# EAGLE design cpu_board (EAGLE 7.7.0)
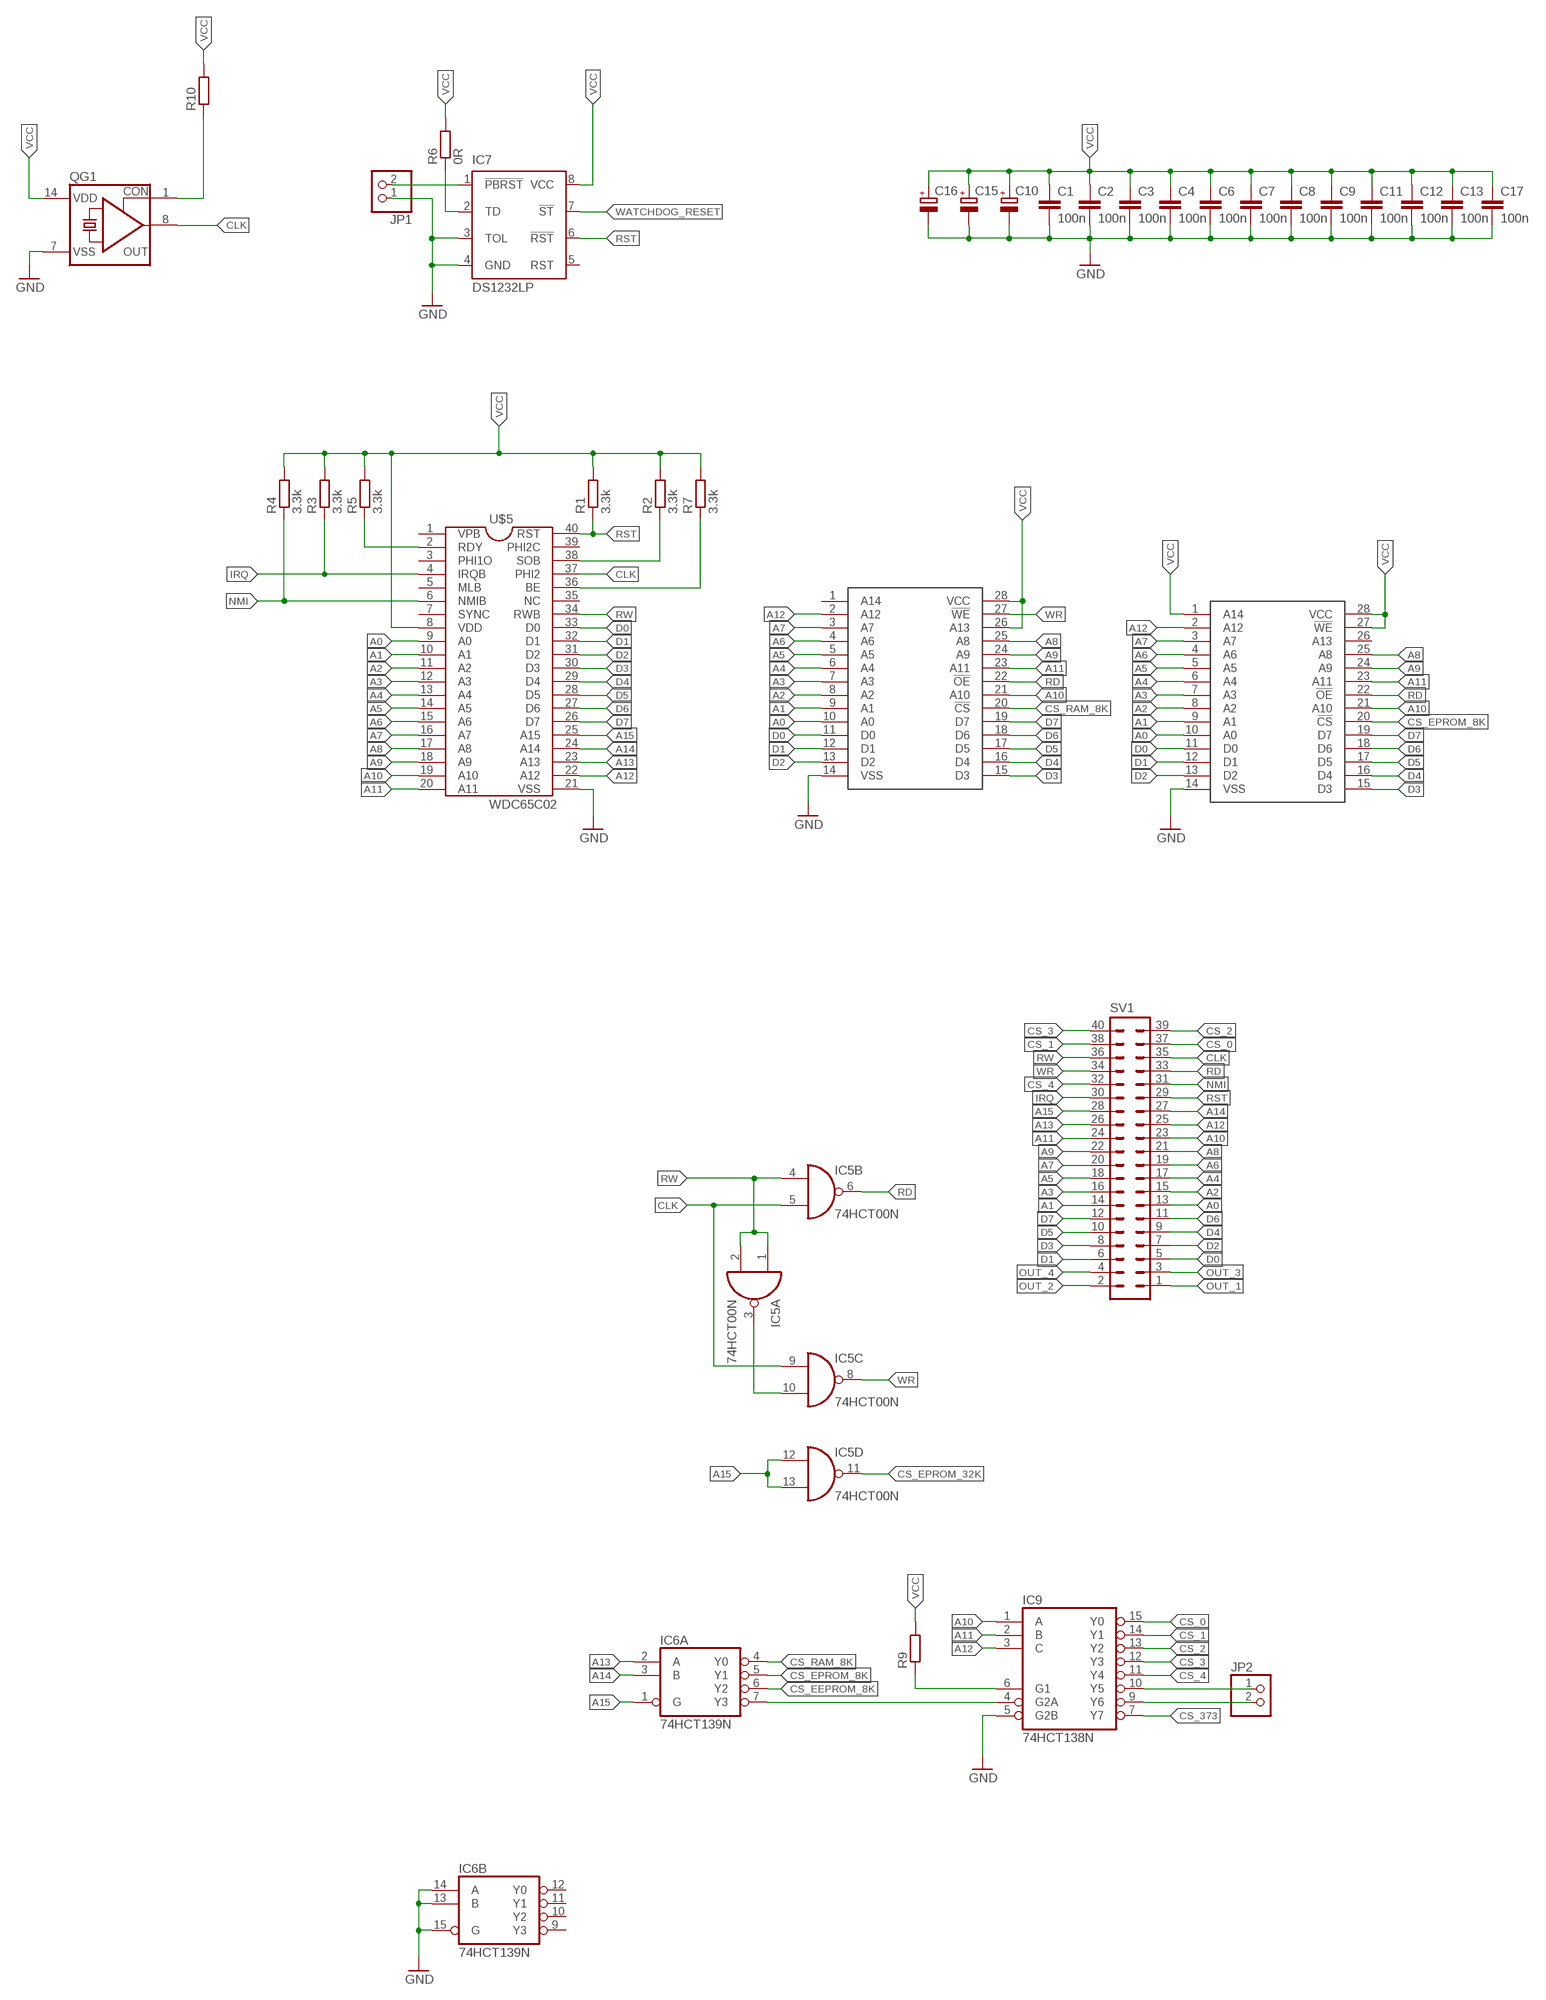
[diagram p0: schematic, sheet 1, part 1 of 2]
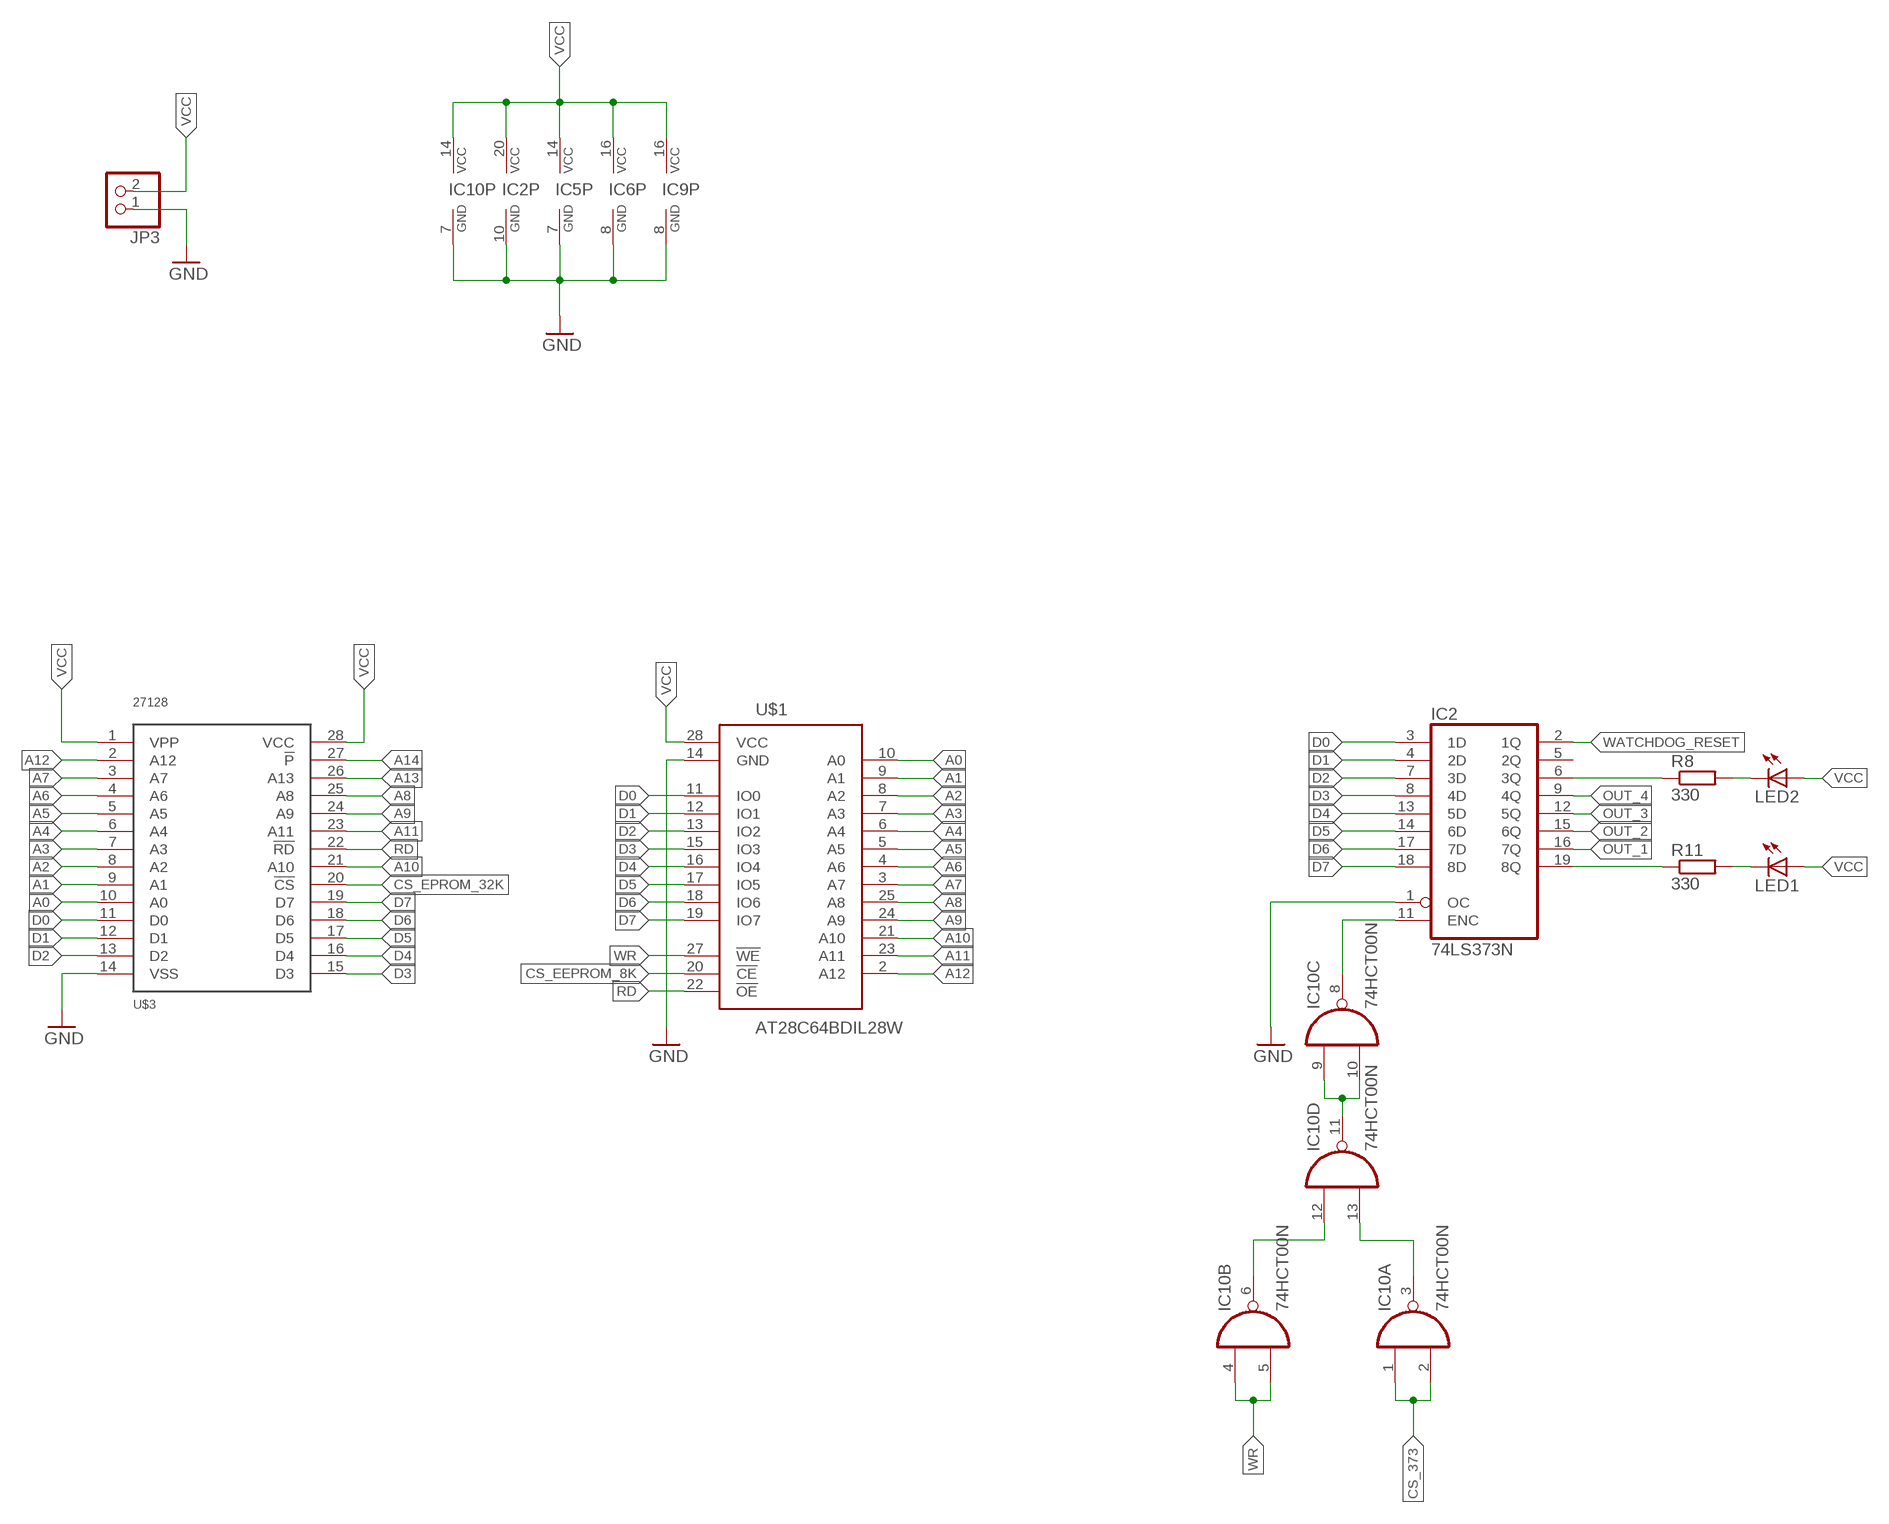
[diagram p1: schematic, sheet 1, part 2 of 2]

## Parts
C1  100n  C-EUC1206  [C1206]
C2  100n  C-EUC1206  [C1206]
C3  100n  C-EUC1206  [C1206]
C4  100n  C-EUC1206  [C1206]
C6  100n  C-EUC1206  [C1206]
C7  100n  C-EUC1206  [C1206]
C8  100n  C-EUC1206  [C1206]
C9  100n  C-EUC1206  [C1206]
C10  CPOL-EUE5-10.5  [E5-10,5]
C11  100n  C-EUC0805  [C0805]
C12  100n  C-EUC0805  [C0805]
C13  100n  C-EUC0805  [C0805]
C15  CPOL-EUSMCB  [SMC_B]
C16  CPOL-EUSMCB  [SMC_B]
C17  100n  C-EUC1206  [C1206]
IC2  74LS373N  [DIL20]
IC5  74HCT00N  [DIL14]
IC6  74HCT139N  [DIL16]
IC7  DS1232LP  [DIL08]
IC9  74HCT138N  [DIL16]
IC10  74HCT00N  [DIL14]
JP1  PINHD-1X2  [1X02]
JP2  PINHD-1X2  [1X02]
JP3  PINHD-1X2/90  [1X02/90]
LED1  LED5MM  [LED5MM]
LED2  LED5MM  [LED5MM]
QG1  CRYSTAL_RES-SG51  [SG51]
R1  3.3k  R-EU_R1206  [R1206]
R2  3.3k  R-EU_R1206  [R1206]
R3  3.3k  R-EU_R1206  [R1206]
R4  3.3k  R-EU_R1206  [R1206]
R5  3.3k  R-EU_R1206  [R1206]
R6  0R  R-EU_R1206  [R1206]
R7  3.3k  R-EU_R1206  [R1206]
R8  330  R-EU_R1206  [R1206]
R9  R-EU_0204/7  [0204/7]
R10  R-EU_R1206  [R1206]
R11  330  R-EU_R1206  [R1206]
SV1  ML40L  [ML40L]
U$1  AT28C64BDIL28W  [DIL28-6]
U$2  62256  [DIL28-6]
U$3  27128  [DIL28]
U$4  62256  [DIL28-6]
U$5  WDC65C02  [DIL40]

## Nets
A0: SV1.13 U$1.10(A0) U$2.10(A0) U$3.10(A0) U$4.10(A0) U$5.9(A0)
A1: SV1.14 U$1.9(A1) U$2.9(A1) U$3.9(A1) U$4.9(A1) U$5.10(A1)
A2: SV1.15 U$1.8(A2) U$2.8(A2) U$3.8(A2) U$4.8(A2) U$5.11(A2)
A3: SV1.16 U$1.7(A3) U$2.7(A3) U$3.7(A3) U$4.7(A3) U$5.12(A3)
A4: SV1.17 U$1.6(A4) U$2.6(A4) U$3.6(A4) U$4.6(A4) U$5.13(A4)
A5: SV1.18 U$1.5(A5) U$2.5(A5) U$3.5(A5) U$4.5(A5) U$5.14(A5)
A6: SV1.19 U$1.4(A6) U$2.4(A6) U$3.4(A6) U$4.4(A6) U$5.15(A6)
A7: SV1.20 U$1.3(A7) U$2.3(A7) U$3.3(A7) U$4.3(A7) U$5.16(A7)
A8: SV1.21 U$1.25(A8) U$2.25(A8) U$3.25(A8) U$4.25(A8) U$5.17(A8)
A9: SV1.22 U$1.24(A9) U$2.24(A9) U$3.24(A9) U$4.24(A9) U$5.18(A9)
A10: IC9.1(A) SV1.23 U$1.21(A10) U$2.21(A10) U$3.21(A10) U$4.21(A10) U$5.19(A10)
A11: IC9.2(B) SV1.24 U$1.23(A11) U$2.23(A11) U$3.23(A11) U$4.23(A11) U$5.20(A11)
A12: IC9.3(C) SV1.25 U$1.2(A12) U$2.2(A12) U$3.2(A12) U$4.2(A12) U$5.22(A12)
A13: IC6.2(A:A) SV1.26 U$3.26(A13) U$5.23(A13)
A14: IC6.3(A:B) SV1.27 U$3.27(!P) U$5.24(A14)
A15: IC5.12(D:I0) IC5.13(D:I1) IC6.1(A:G) SV1.28 U$5.25(A15)
CLK: IC5.5(B:I1) IC5.9(C:I0) QG1.8(OUT) SV1.35 U$5.37(PHI2)
CS_0: IC9.15(Y0) SV1.37
CS_1: IC9.14(Y1) SV1.38
CS_2: IC9.13(Y2) SV1.39
CS_3: IC9.12(Y3) SV1.40
CS_4: IC9.11(Y4) SV1.32
CS_373: IC9.7(Y7) IC10.1(A:I0) IC10.2(A:I1)
CS_EEPROM_8K: IC6.6(A:Y2) U$1.20(!CE)
CS_EPROM_8K: IC6.5(A:Y1) U$2.20(!CS)
CS_EPROM_32K: IC5.11(D:O) U$3.20(!CS)
CS_RAM_8K: IC6.4(A:Y0) U$4.20(!CS)
D0: IC2.3(1D) SV1.5 U$1.11(IO0) U$2.11(D0) U$3.11(D0) U$4.11(D0) U$5.33(D0)
D1: IC2.4(2D) SV1.6 U$1.12(IO1) U$2.12(D1) U$3.12(D1) U$4.12(D1) U$5.32(D1)
D2: IC2.7(3D) SV1.7 U$1.13(IO2) U$2.13(D2) U$3.13(D2) U$4.13(D2) U$5.31(D2)
D3: IC2.8(4D) SV1.8 U$1.15(IO3) U$2.15(D3) U$3.15(D3) U$4.15(D3) U$5.30(D3)
D4: IC2.13(5D) SV1.9 U$1.16(IO4) U$2.16(D4) U$3.16(D4) U$4.16(D4) U$5.29(D4)
D5: IC2.14(6D) SV1.10 U$1.17(IO5) U$2.17(D5) U$3.17(D5) U$4.17(D5) U$5.28(D5)
D6: IC2.17(7D) SV1.11 U$1.18(IO6) U$2.18(D6) U$3.18(D6) U$4.18(D6) U$5.27(D6)
D7: IC2.18(8D) SV1.12 U$1.19(IO7) U$2.19(D7) U$3.19(D7) U$4.19(D7) U$5.26(D7)
GND: C1.2 C2.2 C3.2 C4.2 C6.2 C7.2 C8.2 C9.2 C10.- C11.2 C12.2 C13.2 C15.- C16.- C17.2 IC2.1(OC) IC2.10(GND) IC5.7(P:GND) IC6.8(P:GND) IC6.13(B:B) IC6.14(B:A) IC6.15(B:G) IC7.3(TOL) IC7.4(GND) IC9.5(G2B) IC9.8(GND) IC10.7(P:GND) JP1.1 JP3.1 QG1.7(VSS) U$1.14(GND) U$2.14(VSS) U$3.14(VSS) U$4.14(VSS) U$5.21(VSS)
IRQ: R3.1 SV1.30 U$5.4(IRQB)
N$1: IC7.2(TD) R6.1
N$2: R2.1 U$5.38(SOB)
N$3: IC7.1(!PBRST) JP1.2
N$4: R7.1 U$5.36(BE)
N$5: R5.1 U$5.2(RDY)
N$6: IC2.19(8Q) R11.1
N$7: QG1.1(CON) R10.1
N$8: IC6.7(A:Y3) IC9.4(G2A)
N$9: LED1.K(C) R11.2
N$11: IC2.11(ENC) IC10.8(C:O)
N$12: IC10.9(C:I0) IC10.10(C:I1) IC10.11(D:O)
N$13: IC10.3(A:O) IC10.13(D:I1)
N$14: IC10.6(B:O) IC10.12(D:I0)
N$15: IC2.6(3Q) R8.1
N$16: IC9.10(Y5) JP2.1
N$17: LED2.K(C) R8.2
N$18: IC5.3(A:O) IC5.10(C:I1)
N$20: IC9.6(G1) R9.1
N$22: IC9.9(Y6) JP2.2
NMI: R4.1 SV1.31 U$5.6(NMIB)
OUT_1: IC2.16(7Q) SV1.1
OUT_2: IC2.15(6Q) SV1.2
OUT_3: IC2.12(5Q) SV1.3
OUT_4: IC2.9(4Q) SV1.4
RD: IC5.6(B:O) SV1.33 U$1.22(!OE) U$2.22(!OE) U$3.22(!RD) U$4.22(!OE)
RST: IC7.6(!RST) R1.1 SV1.29 U$5.40(RST)
RW: IC5.1(A:I0) IC5.2(A:I1) IC5.4(B:I0) SV1.36 U$5.34(RWB)
VCC: C1.1 C2.1 C3.1 C4.1 C6.1 C7.1 C8.1 C9.1 C10.+ C11.1 C12.1 C13.1 C15.+ C16.+ C17.1 IC2.20(VCC) IC5.14(P:VCC) IC6.16(P:VCC) IC7.8(VCC) IC9.16(VCC) IC10.14(P:VCC) JP3.2 LED1.A LED2.A QG1.14(VDD) R1.2 R2.2 R3.2 R4.2 R5.2 R6.2 R7.2 R9.2 R10.2 U$1.28(VCC) U$2.1(A14) U$2.27(!WE) U$2.28(VCC) U$3.1(VPP) U$3.28(VCC) U$4.26(A13) U$4.28(VCC) U$5.8(VDD)
WATCHDOG_RESET: IC2.2(1Q) IC7.7(!ST)
WR: IC5.8(C:O) IC10.4(B:I0) IC10.5(B:I1) SV1.34 U$1.27(!WE) U$4.27(!WE)
Unconnected: IC2.5(2Q) IC6.9(B:Y3) IC6.10(B:Y2) IC6.11(B:Y1) IC6.12(B:Y0) IC7.5(RST) U$2.26(A13) U$4.1(A14) U$5.1(VPB) U$5.3(PHI1O) U$5.5(MLB) U$5.7(SYNC) U$5.35(NC) U$5.39(PHI2C)

## Library data of the parts
C1-C4 C6-C9 C11-C13 C17 = rcl:C-EU: CAPACITOR, European symbol
C10 C15 C16 = rcl:CPOL-EU: POLARIZED CAPACITOR, European symbol
IC2 = 74xx-eu:74*373: Octal D type transparent LATCH, edge triggered
IC5 IC10 = 74xx-eu:74*00: Quad 2-input NAND gate
IC6 = 74xx-eu:74*139: Dual 2-line to 4-line DECODER/DEMULTIPLEXER
IC7 = texas:DS1232LP: Low Power MicroMonitor Chip Source: DALLAS SEMICONDUCTOR .. 1232lp.pdf; MPN: DS1232LP+; OC_FARNELL: 1187997; OC_NEWARK: 68K3327
IC9 = 74xx-eu:74*138: 3-line to 8-line DECODER/DEMULTIPLEXER
JP1-JP3 = pinhead:PINHD-1X2: PIN HEADER
LED1 LED2 = led:LED: LED OSRAM: - CHIPLED LG R971, LG N971, LY N971, LG Q971, LY Q971, LO R971, LY R971 LH N974, LH R974 LS Q976, LO Q976, LY Q976 LO Q996 - Hyper CHIPLED LW Q18S LB Q993, LB Q99A, LB R99A - SideLED LS A670, LO A670, LY A670, LG A670, LP A670 LB A673, LV A673, LT A673, LW A673 LH A674 LY A675 LS A676, LA A676, LO A676, LY A676, LW A676 LS A679, LY A679, LG A679 - Hyper Micro SIDELED® LS Y876, LA Y876, LO Y876, LY Y876 LT Y87S - SmartLED LW L88C, LW L88S LB L89C, LB L89S, LG L890 LS L89K, LO L89K, LY L89K LS L896, LA L896, LO L896, LY L896 - TOPLED LS T670, LO T670, LY T670, LG T670, LP T670 LSG T670, LSP T670, LSY T670, LOP T670, LYG T670 LG T671, LOG T671, LSG T671 LB T673, LV T673, LT T673, LW T673 LH T674 LS T676, LA T676, LO T676, LY T676, LB T676, LH T676, LSB T676, LW T676 LB T67C, LV T67C, LT T67C, LS T67K, LO T67K, LY T67K, LW E67C LS E67B, LA E67B, LO E67B, LY E67B, LB E67C, LV E67C, LT E67C LW T67C LS T679, LY T679, LG T679 LS T770, LO T770, LY T770, LG T770, LP T770 LB T773, LV T773, LT T773, LW T773 LH T774 LS E675, LA E675, LY E675, LS T675 LS T776, LA T776, LO T776, LY T776, LB T776 LHGB T686 LT T68C, LB T68C - Hyper Mini TOPLED® LB M676 - Mini TOPLED Santana® LG M470 LS M47K, LO M47K, LY M47K Source: http://www.osram.convergy.de LUXEON: - LUMILED® LXK2-PW12-R00, LXK2-PW12-S00, LXK2-PW14-U00, LXK2-PW14-V00 LXK2-PM12-R00, LXK2-PM12-S00, LXK2-PM14-U00 LXK2-PE12-Q00, LXK2-PE12-R00, LXK2-PE12-S00, LXK2-PE14-T00, LXK2-PE14-U00 LXK2-PB12-K00, LXK2-PB12-L00, LXK2-PB12-M00, LXK2-PB14-N00, LXK2-PB14-P00, LXK2-PB14-Q00 LXK2-PR12-L00, LXK2-PR12-M00, LXK2-PR14-Q00, LXK2-PR14-R00 LXK2-PD12-Q00, LXK2-PD12-R00, LXK2-PD12-S00 LXK2-PH12-R00, LXK2-PH12-S00 LXK2-PL12-P00, LXK2-PL12-Q00, LXK2-PL12-R00 Source: www.luxeon.com KINGBRIGHT: KA-3528ASYC Source: www.kingbright.com
QG1 = crystal:CRYSTAL_RES-: CRYSTAL RESONATOR; OC_FARNELL: unknown; OC_NEWARK: unknown
R1-R11 = rcl:R-EU_: RESISTOR, European symbol
SV1 = con-harting-ml:ML40: HARTING; OC_FARNELL: unknown; OC_NEWARK: unknown
U$1 = bt_memory:AT28C64B: AT28C64B EEPROM The AT28C64B is a high-performance electrically-erasable and programmable read-only memory (EEPROM). Its 64K of memory is organized as 8,192 words by 8 bits. Manufactured with Atmel’s advanced nonvolatile CMOS technology, the device offers access times to 150 ns with power dissipation of just 220 mW. When the device is deselected, the CMOS standby current is less than 100 µA.
U$2 U$4 = memory-sram:62256
U$3 = mw:27128
U$5 = Mos6502:WDC65C02

## Board
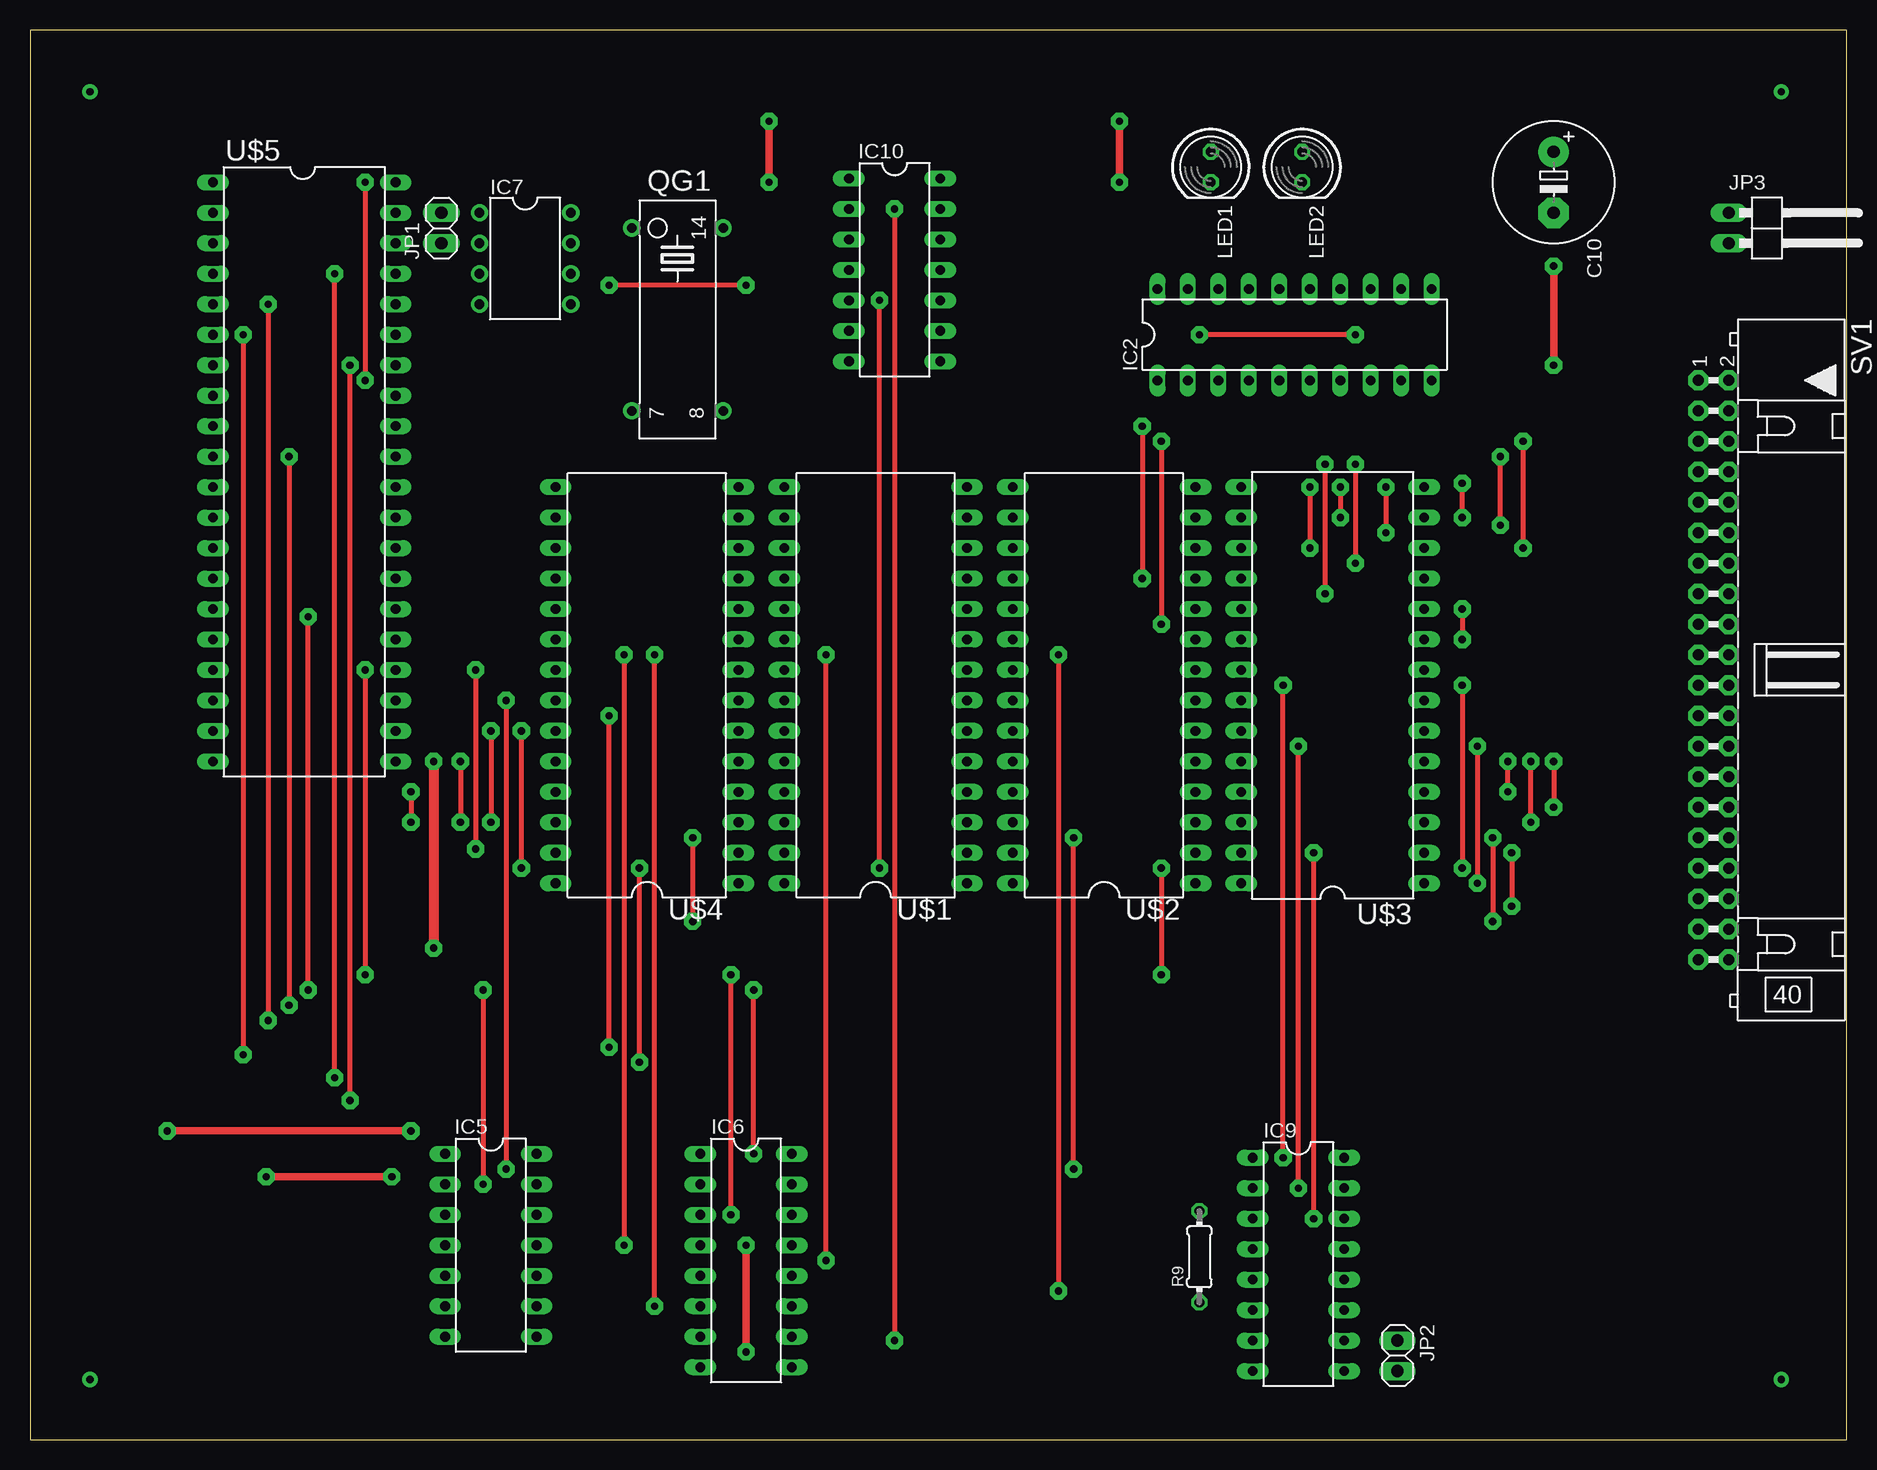
[diagram p2: board, top side]
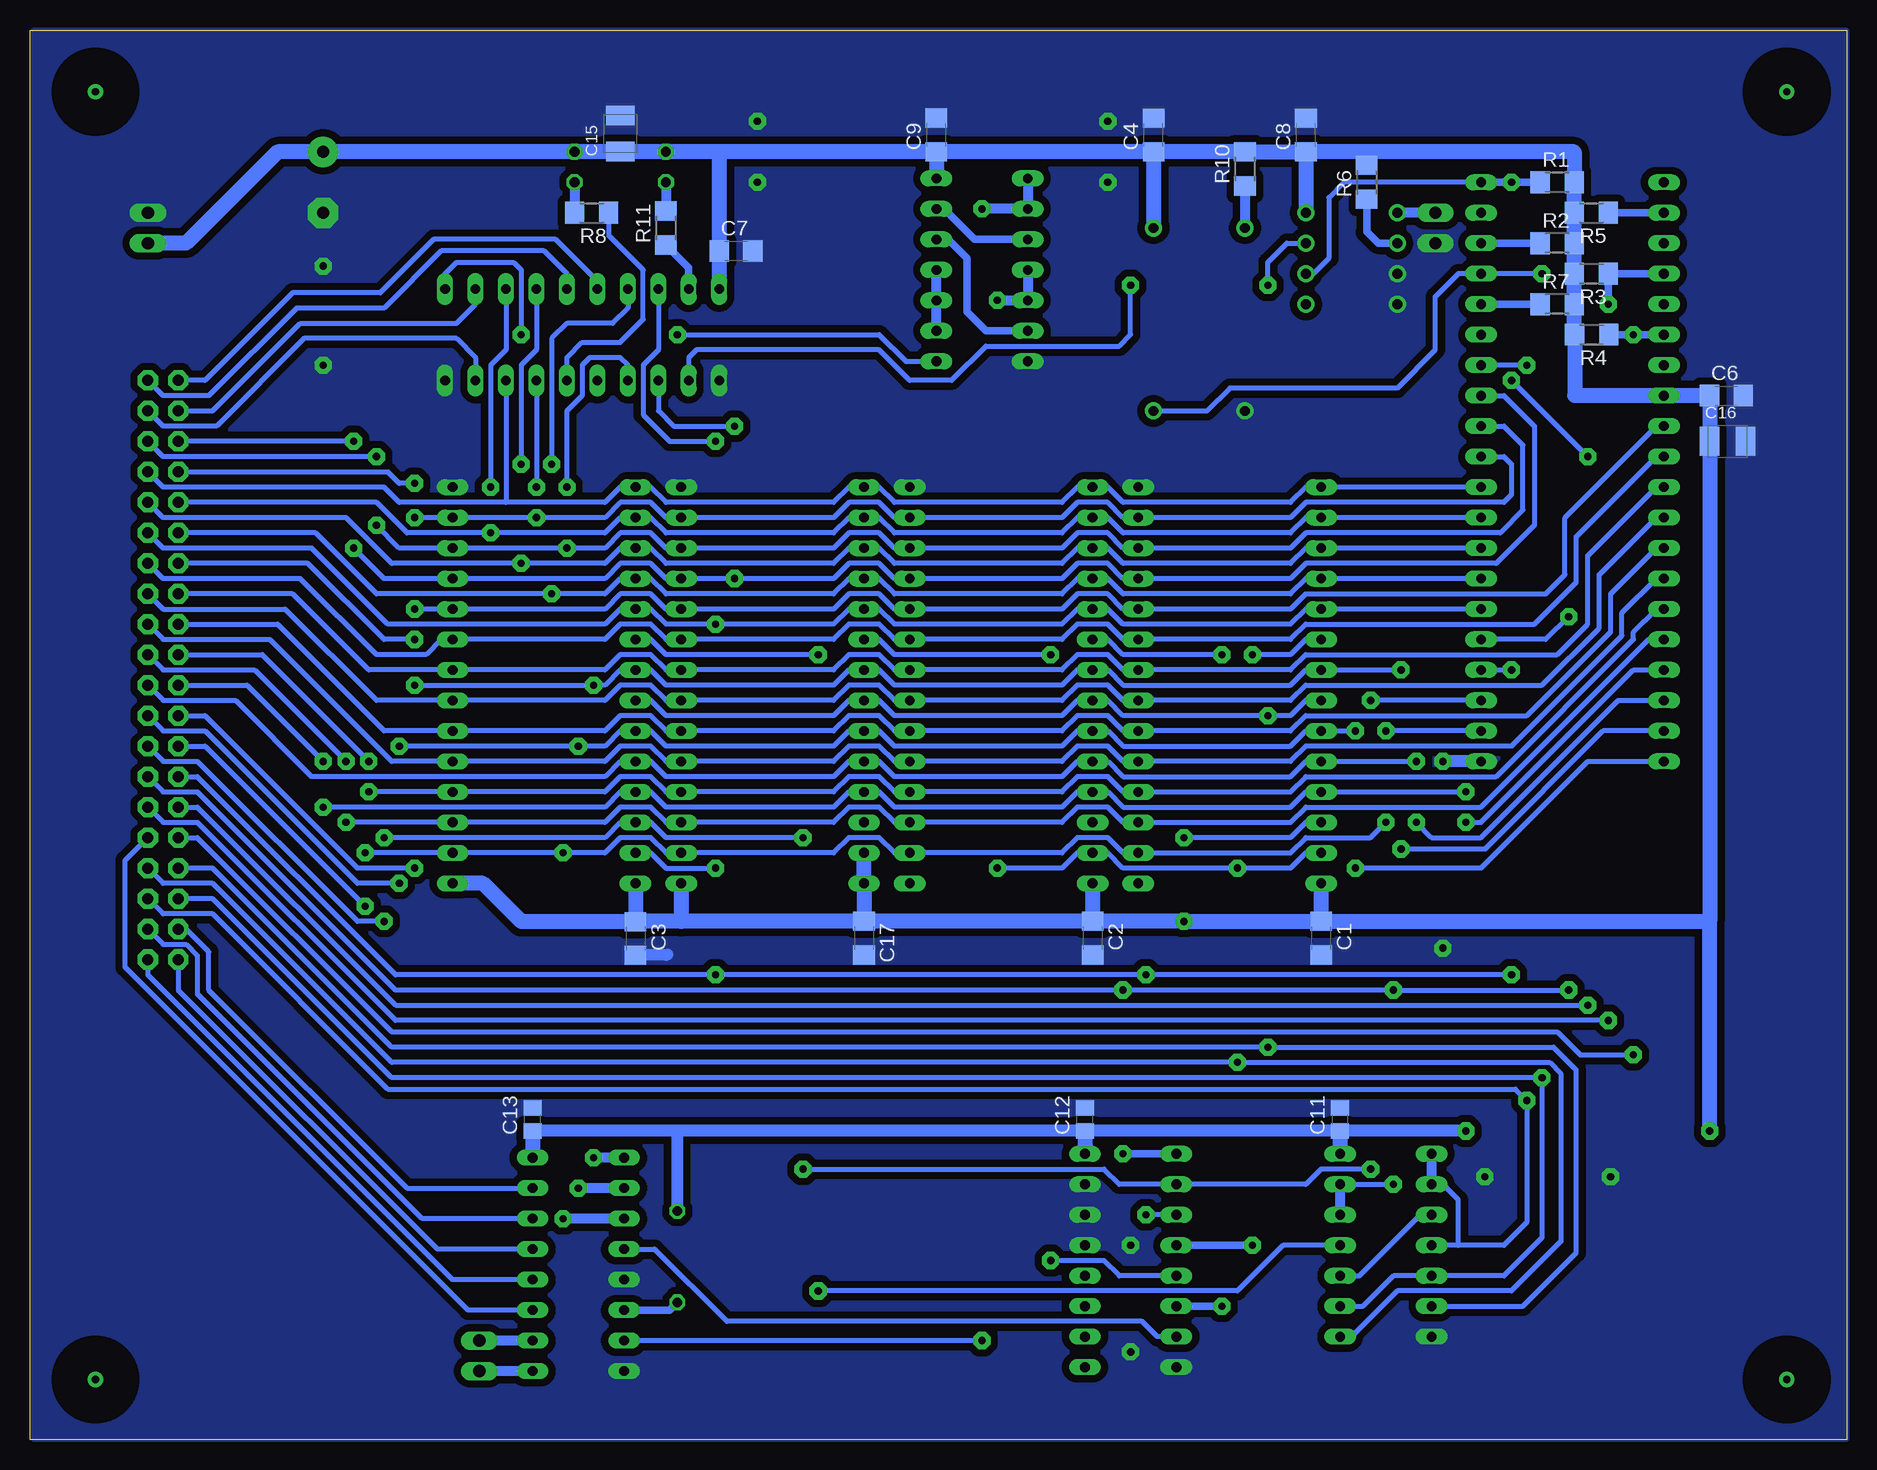
[diagram p3: board, bottom side, seen from below]

Size 151.44 x 117.47 mm. Coordinates in mm from the lower left corner, seen from the top.
Outline: 0,0 151.44,0 151.44,117.47 0,117.47 0,0
Copper layers (1*16): Top 0.035mm / dielectric 1.5mm / Bottom 0.035mm
Design rules "default *": minimum track width 10mil, minimum drill 24mil, track to track 8mil, track to pad 8mil, pad to pad 8mil, via to via 8mil, smd to smd 8mil, copper to edge 0mil, drill to drill 8mil, minimum pad ring 10mil, minimum via ring 8mil, stop-mask expansion 4mil, vias tented up to drill 0mil, thermal gap 10mil
bRestrict: area 2,2 to 8,8; area 2,109.3 to 8,115.4; area 142.9,2 to 149,8; area 142.9,109.3 to 149,115.4

### Footprints (pad centres in the part's own frame; a part is rotated, then mirrored left to right if it is on the bottom)
C1206 = smd 1.6 x 1.8: 1 -1.4,0; 2 1.4,0
E5-10,5 = drill 1.016 pad 2.54: + -2.54,0 | drill 1.016 pad 2.54 octagon: - 2.54,0
C0805 = smd 1.3 x 1.5: 1 -0.95,0; 2 0.95,0
SMC_B = smd 1.6 x 2.4: + -1.5,0; - 1.5,0
DIL20 = drill 0.813 long: 1 -11.43,-3.81; 2 -8.89,-3.81; 3 -6.35,-3.81; 4 -3.81,-3.81; 5 -1.27,-3.81; 6 1.27,-3.81; 7 3.81,-3.81; 8 6.35,-3.81; 9 8.89,-3.81; 10 11.43,-3.81; 11 11.43,3.81; 12 8.89,3.81; 13 6.35,3.81; 14 3.81,3.81; 15 1.27,3.81; 16 -1.27,3.81; 17 -3.81,3.81; 18 -6.35,3.81; 19 -8.89,3.81; 20 -11.43,3.81
DIL14 = drill 0.813 long: 1 -7.62,-3.81; 2 -5.08,-3.81; 3 -2.54,-3.81; 4 0,-3.81; 5 2.54,-3.81; 6 5.08,-3.81; 7 7.62,-3.81; 8 7.62,3.81; 9 5.08,3.81; 10 2.54,3.81; 11 0,3.81; 12 -2.54,3.81; 13 -5.08,3.81; 14 -7.62,3.81
DIL16 = drill 0.813 long: 1 -8.89,-3.81; 2 -6.35,-3.81; 3 -3.81,-3.81; 4 -1.27,-3.81; 5 1.27,-3.81; 6 3.81,-3.81; 7 6.35,-3.81; 8 8.89,-3.81; 9 8.89,3.81; 10 6.35,3.81; 11 3.81,3.81; 12 1.27,3.81; 13 -1.27,3.81; 14 -3.81,3.81; 15 -6.35,3.81; 16 -8.89,3.81
DIL08 = drill 0.813 pad 1.422: 1 -3.81,-3.81; 2 -1.27,-3.81; 3 1.27,-3.81; 4 3.81,-3.81; 5 3.81,3.81; 6 1.27,3.81; 7 -1.27,3.81; 8 -3.81,3.81
1X02 = drill 1.016 long: 1 -1.27,0; 2 1.27,0
1X02/90 = drill 1.016 long: 1 -1.27,-3.81; 2 1.27,-3.81
LED5MM = drill 0.813 octagon: A -1.27,0; K 1.27,0
SG51 = drill 0.813 pad 1.422: 1 -7.62,-3.81; 7 7.62,-3.81; 8 7.62,3.81; 14 -7.62,3.81
R1206 = smd 1.6 x 1.803: 1 -1.422,0; 2 1.422,0
0204/7 = drill 0.813 octagon: 1 -3.81,0; 2 3.81,0
ML40L = drill 0.914 pad 1.676 octagon: 1 -24.13,-1.27; 2 -24.13,1.27; 3 -21.59,-1.27; 4 -21.59,1.27; 5 -19.05,-1.27; 6 -19.05,1.27; 7 -16.51,-1.27; 8 -16.51,1.27; 9 -13.97,-1.27; 10 -13.97,1.27; 11 -11.43,-1.27; 12 -11.43,1.27; 13 -8.89,-1.27; 14 -8.89,1.27; 15 -6.35,-1.27; 16 -6.35,1.27; 17 -3.81,-1.27; 18 -3.81,1.27; 19 -1.27,-1.27; 20 -1.27,1.27; 21 1.27,-1.27; 22 1.27,1.27; 23 3.81,-1.27; 24 3.81,1.27; 25 6.35,-1.27; 26 6.35,1.27; 27 8.89,-1.27; 28 8.89,1.27; 29 11.43,-1.27; 30 11.43,1.27; 31 13.97,-1.27; 32 13.97,1.27; 33 16.51,-1.27; 34 16.51,1.27; 35 19.05,-1.27; 36 19.05,1.27; 37 21.59,-1.27; 38 21.59,1.27; 39 24.13,-1.27; 40 24.13,1.27
DIL28-6 = drill 0.813 long: 1 -16.51,-7.62; 2 -13.97,-7.62; 3 -11.43,-7.62; 4 -8.89,-7.62; 5 -6.35,-7.62; 6 -3.81,-7.62; 7 -1.27,-7.62; 8 1.27,-7.62; 9 3.81,-7.62; 10 6.35,-7.62; 11 8.89,-7.62; 12 11.43,-7.62; 13 13.97,-7.62; 14 16.51,-7.62; 15 16.51,7.62; 16 13.97,7.62; 17 11.43,7.62; 18 8.89,7.62; 19 6.35,7.62; 20 3.81,7.62; 21 1.27,7.62; 22 -1.27,7.62; 23 -3.81,7.62; 24 -6.35,7.62; 25 -8.89,7.62; 26 -11.43,7.62; 27 -13.97,7.62; 28 -16.51,7.62
DIL28 = drill 0.813 long: 1 -16.51,-7.62; 2 -13.97,-7.62; 3 -11.43,-7.62; 4 -8.89,-7.62; 5 -6.35,-7.62; 6 -3.81,-7.62; 7 -1.27,-7.62; 8 1.27,-7.62; 9 3.81,-7.62; 10 6.35,-7.62; 11 8.89,-7.62; 12 11.43,-7.62; 13 13.97,-7.62; 14 16.51,-7.62; 15 16.51,7.62; 16 13.97,7.62; 17 11.43,7.62; 18 8.89,7.62; 19 6.35,7.62; 20 3.81,7.62; 21 1.27,7.62; 22 -1.27,7.62; 23 -3.81,7.62; 24 -6.35,7.62; 25 -8.89,7.62; 26 -11.43,7.62; 27 -13.97,7.62; 28 -16.51,7.62
DIL40 = drill 0.813 long: 1 -24.13,-7.62; 2 -21.59,-7.62; 3 -19.05,-7.62; 4 -16.51,-7.62; 5 -13.97,-7.62; 6 -11.43,-7.62; 7 -8.89,-7.62; 8 -6.35,-7.62; 9 -3.81,-7.62; 10 -1.27,-7.62; 11 1.27,-7.62; 12 3.81,-7.62; 13 6.35,-7.62; 14 8.89,-7.62; 15 11.43,-7.62; 16 13.97,-7.62; 17 16.51,-7.62; 18 19.05,-7.62; 19 21.59,-7.62; 20 24.13,-7.62; 21 24.13,7.62; 22 21.59,7.62; 23 19.05,7.62; 24 16.51,7.62; 25 13.97,7.62; 26 11.43,7.62; 27 8.89,7.62; 28 6.35,7.62; 29 3.81,7.62; 30 1.27,7.62; 31 -1.27,7.62; 32 -3.81,7.62; 33 -6.35,7.62; 34 -8.89,7.62; 35 -11.43,7.62; 36 -13.97,7.62; 37 -16.51,7.62; 38 -19.05,7.62; 39 -21.59,7.62; 40 -24.13,7.62

### Placement (x,y rotation side)
C1  43.81,41.78 270 bottom
C2  62.87,41.78 270 bottom
C3  100.97,41.76 270 bottom
C4  57.78,108.71 90 bottom
C6  10.03,87 0 bottom
C7  92.58,99.06 0 bottom
C8  45.09,108.71 90 bottom
C9  75.88,108.72 90 bottom
C10  127,104.78 270 top
C11  42.23,26.67 90 bottom
C12  63.5,26.67 90 bottom
C13  109.54,26.67 90 bottom
C15  102.23,108.84 90 bottom
C16  9.93,83.19 0 bottom
C17  81.92,41.78 270 bottom
IC2  105.41,92.08 0 top
IC5  38.42,16.19 270 top
IC6  59.69,14.92 270 top
IC7  41.27,98.42 270 top
IC9  105.73,14.61 270 top
IC10  72.07,97.47 270 top
JP1  34.29,100.97 90 top
JP2  113.98,6.99 270 top
JP3  145.41,100.97 270 top
LED1  98.42,106.05 270 top
LED2  106.05,106.05 270 top
QG1  53.98,93.34 270 top
R1  24.13,104.78 0 bottom
R2  24.13,99.69 0 bottom
R3  21.29,97.16 180 bottom
R4  21.26,92.08 180 bottom
R5  21.29,102.23 180 bottom
R6  40.01,104.78 90 bottom
R7  24.13,94.61 0 bottom
R8  104.62,102.23 180 bottom
R9  97.47,15.24 90 top
R10  50.16,105.89 90 bottom
R11  98.42,100.97 90 bottom
SV1  140.34,64.14 270 top
U$1  70.48,62.87 90 top
U$2  89.53,62.87 90 top
U$3  108.58,62.87 90 top
U$4  51.44,62.87 90 top
U$5  22.86,80.64 270 top

### Tracks (layer width: path | path; a pad name or v marks a point on that pad's centre or on a via)
A0  (via drill 0.6 pad 1.42)
  Top 0.406: v119.38,69.22 v119.38,66.67
  Bottom 0.406: U$5.9 15.88,84.45 23.5,76.83 23.5,72.07 25.08,70.48 45.09,70.48 46.35,69.22 U$4.10 60.33,69.22 61.59,70.48 64.14,70.48 65.41,69.22 U$1.10 79.38,69.22 80.64,70.48 83.19,70.48 84.45,69.22 U$2.10 98.42,69.22 99.69,70.48 102.23,70.48 103.5,69.22 U$3.10 v119.38,69.22 | v119.38,66.67 121.92,66.67 128.27,73.03 SV1.13
A1
  Bottom 0.406: U$5.10 15.88,81.92 22.54,75.25 22.54,71.44 26.04,67.94 45.09,67.94 46.35,66.67 U$4.9 60.33,66.67 61.59,67.94 64.14,67.94 65.41,66.67 U$1.9 79.38,66.67 80.64,67.94 83.19,67.94 84.45,66.67 U$2.9 98.42,66.67 99.69,67.94 102.23,67.94 103.5,66.67 U$3.9 117.16,66.67 118.43,65.41 122.56,65.41 128.91,71.75 140.34,71.75 SV1.14
A2
  Bottom 0.406: U$5.11 15.88,79.38 21.59,73.66 21.59,67.94 24.13,65.41 45.09,65.41 46.35,64.14 U$4.8 60.33,64.14 61.59,65.41 64.14,65.41 65.41,64.14 U$1.8 79.38,64.14 80.64,65.41 83.19,65.41 84.45,64.14 U$2.8 98.42,64.14 99.69,65.41 102.23,65.41 103.5,64.14 U$3.8 123.19,64.14 129.54,70.48 SV1.15
A3
  Bottom 0.406: U$5.12 15.88,76.83 20.64,72.07 20.64,67.63 25.4,62.87 45.09,62.87 46.35,61.59 U$4.7 60.33,61.59 61.59,62.87 64.14,62.87 65.41,61.59 U$1.7 79.38,61.59 80.64,62.87 83.19,62.87 84.45,61.59 U$2.7 98.42,61.59 99.69,62.87 102.23,62.87 103.5,61.59 U$3.7 122.56,61.59 130.18,69.22 140.34,69.22 SV1.16
A4
  Bottom 0.406: U$5.13 15.88,74.3 19.68,70.48 19.68,67.31 26.67,60.33 45.09,60.33 46.35,59.05 U$4.6 60.33,59.05 61.59,60.33 64.14,60.33 65.41,59.05 U$1.6 79.38,59.05 80.64,60.33 83.19,60.33 84.45,59.05 U$2.6 98.42,59.05 99.69,60.33 102.23,60.33 103.5,59.05 U$3.6 121.92,59.05 130.81,67.94 SV1.17
A5
  Bottom 0.406: U$5.14 15.88,71.75 18.73,68.9 18.73,66.99 27.94,57.78 45.09,57.78 46.35,56.52 U$4.5 60.33,56.52 61.59,57.78 64.14,57.78 65.41,56.52 U$1.5 79.38,56.52 80.64,57.78 83.19,57.78 84.45,56.52 U$2.5 98.42,56.52 99.69,57.78 102.23,57.78 103.5,56.52 U$3.5 121.28,56.52 131.44,66.67 140.34,66.67 SV1.18
A6  (via drill 0.6 pad 1.42)
  Top 0.406: v123.19,53.98 v123.19,56.52
  Bottom 0.406: U$5.15 15.88,69.22 17.78,67.31 17.78,66.67 29.21,55.24 45.09,55.24 46.35,53.98 U$4.4 60.33,53.98 61.59,55.24 64.14,55.24 65.41,53.98 U$1.4 79.38,53.98 80.64,55.24 83.19,55.24 84.45,53.98 U$2.4 98.42,53.98 99.69,55.24 102.23,55.24 103.5,53.98 U$3.4 v123.19,53.98 | SV1.19 132.08,65.41 v123.19,56.52
A7  (via drill 0.6 pad 1.42)
  Top 0.406: v125.09,51.44 v125.09,56.52
  Bottom 0.406: U$5.16 16.51,66.67 30.48,52.7 45.09,52.7 46.35,51.44 U$4.3 60.33,51.44 61.59,52.7 64.14,52.7 65.41,51.44 U$1.3 79.38,51.44 80.64,52.7 83.19,52.7 84.45,51.44 U$2.3 98.42,51.44 99.69,52.7 102.23,52.7 103.5,51.44 U$3.3 v125.09,51.44 | SV1.20 140.34,64.14 132.72,64.14 v125.09,56.52
A8  (via drill 0.6 pad 1.42)
  Top 0.406: v31.75,53.98 v31.75,51.44 | v127,56.52 v127,52.7
  Bottom 0.406: v31.75,53.98 U$4.25 45.09,53.98 46.35,52.7 60.33,52.7 61.59,53.98 U$1.25 64.14,53.98 65.41,52.7 79.38,52.7 80.64,53.98 U$2.25 83.19,53.98 84.45,52.7 98.42,52.7 99.69,53.98 U$3.25 102.23,53.98 103.5,52.7 v127,52.7 | U$5.17 17.78,64.14 30.48,51.44 v31.75,51.44 | SV1.21 133.35,62.87 v127,56.52
A9  (via drill 0.6 pad 1.42)
  Top 0.406: v35.88,56.52 v35.88,51.44
  Bottom 0.406: v35.88,56.52 U$4.24 45.09,56.52 46.35,55.24 60.33,55.24 61.59,56.52 U$1.24 64.14,56.52 65.41,55.24 79.38,55.24 80.64,56.52 U$2.24 83.19,56.52 84.45,55.24 98.42,55.24 99.69,56.52 U$3.24 102.23,56.52 103.5,55.24 127.95,55.24 134.3,61.59 140.34,61.59 SV1.22 | U$5.18 19.05,61.59 30.48,50.16 34.61,50.16 v35.88,51.44
A10  (via drill 0.6 pad 1.42)
  Top 0.406: v37.15,64.14 v37.15,49.21 | v119.38,62.87 v119.38,47.62 | v104.46,23.5 v104.46,62.87
  Bottom 0.406: v37.15,64.14 U$4.21 45.09,64.14 46.35,62.87 60.33,62.87 61.59,64.14 U$1.21 64.14,64.14 65.41,62.87 79.38,62.87 80.64,64.14 U$2.21 83.19,64.14 84.45,62.87 98.42,62.87 99.69,64.14 U$3.21 102.23,64.14 103.5,62.87 v104.46,62.87 v119.38,62.87 | U$5.19 20.32,59.05 30.16,49.21 v37.15,49.21 | v119.38,47.62 124.14,47.62 136.84,60.33 SV1.23
  Bottom 0.813: IC9.1 v104.46,23.5
A11  (via drill 0.6 pad 1.42)
  Top 0.406: v40.96,59.05 v40.96,47.62 | v120.65,57.78 v120.65,46.35 | v105.73,20.95 v105.73,57.78
  Bottom 0.406: v40.96,59.05 U$4.23 45.09,59.05 46.35,57.78 60.33,57.78 61.59,59.05 U$1.23 64.14,59.05 65.41,57.78 79.38,57.78 80.64,59.05 U$2.23 83.19,59.05 84.45,57.78 98.42,57.78 99.69,59.05 U$3.23 102.23,59.05 103.5,57.78 v105.73,57.78 v120.65,57.78 | U$5.20 21.59,56.52 30.48,47.62 v40.96,47.62 | SV1.24 140.34,59.05 136.84,59.05 124.14,46.35 v120.65,46.35
  Bottom 0.813: IC9.2 v105.73,20.95
A12  (via drill 0.6 pad 1.42)
  Top 0.406: v38.42,59.05 v38.42,51.44 | v123.51,48.9 v123.51,44.45 | v107,48.9 v107,18.41
  Bottom 0.406: U$5.22 v38.42,59.05 | v123.51,48.9 U$3.2 v107,48.9 103.5,48.9 102.23,50.16 99.69,50.16 98.42,48.9 U$2.2 84.45,48.9 83.19,50.16 80.64,50.16 79.38,48.9 U$1.2 65.41,48.9 64.14,50.16 61.59,50.16 60.33,48.9 U$4.2 46.35,48.9 45.09,50.16 39.69,50.16 v38.42,51.44 | SV1.25 136.84,57.78 v123.51,44.45
  Bottom 0.813: IC9.3 v107,18.41
A13  (via drill 0.6 pad 1.42)
  Top 0.406: v39.69,61.59 v39.69,22.54 | v121.92,50.16 v121.92,43.18 | v87,22.54 v87,50.16
  Bottom 0.406: U$5.23 v39.69,61.59 | SV1.26 140.34,56.52 137.48,56.52 124.14,43.18 v121.92,43.18 | v121.92,50.16 103.5,50.16 102.23,51.44 U$3.26 99.69,51.44 98.42,50.16 v87,50.16 | v87,22.54 61.91,22.54 60.64,21.27 IC6.2 45.09,21.27 43.81,22.54 v39.69,22.54
A14  (via drill 0.6 pad 1.42)
  Top 0.406: v27.94,64.14 v27.94,38.73 | v94.3,47.62 v94.3,38.73 | v58.42,18.73 v58.42,38.73
  Bottom 0.406: U$5.24 v27.94,64.14 | U$3.27 99.69,48.9 98.42,47.62 v94.3,47.62 | IC6.3 v58.42,18.73 | v58.42,38.73 v27.94,38.73 v94.3,38.73 120.97,38.73 137.48,55.24 SV1.27
A15  (via drill 0.6 pad 1.42)
  Top 0.406: v60.33,23.81 v60.33,37.47 | v37.78,37.47 v37.78,21.27 | v23.18,37.47 v23.18,68.58
  Bottom 0.406: IC5.13 v37.78,21.27 | v23.18,68.58 25.08,66.67 U$5.25 | v23.18,37.47 v37.78,37.47 v60.33,37.47 120.97,37.47 137.48,53.98 140.34,53.98 SV1.28
  Bottom 0.61: v60.33,23.81 IC6.1
  Bottom 0.813: IC5.13 IC5.12
CLK  (via drill 0.6 pad 1.42)
  Top 0.406: v25.4,30.16 v25.4,97.16
  Bottom 0.406: QG1.8 53.34,85.72 51.44,87.63 37.47,87.63 34.29,90.81 34.29,95.25 32.38,97.16 U$5.37 v25.4,97.16 | IC5.9 40.32,11.11 37.78,13.65 IC5.5 28.57,13.65 25.4,16.83 v25.4,30.16 121.28,30.16 136.21,45.09 SV1.35
CS_0
  Bottom 0.406: IC9.15 120.02,20.95 136.53,37.47 136.53,40.64 138.43,42.55 SV1.37
CS_1
  Bottom 0.406: IC9.14 118.75,18.41 137.48,37.15 137.48,40.32 138.43,41.27 140.34,41.27 SV1.38
CS_2
  Bottom 0.406: IC9.13 117.47,15.88 139.06,37.47 SV1.39
CS_3
  Bottom 0.406: IC9.12 116.2,13.34 141.6,38.73 SV1.40
CS_4
  Bottom 0.406: IC9.11 114.94,10.79 143.51,39.37 143.51,48.26 SV1.32
CS_373  (via drill 0.6 pad 1.42)
  Top 0.406: v72.07,102.55 v72.07,8.26
  Bottom 0.406: v72.07,8.26 IC9.7
  Bottom 0.813: IC10.1 IC10.2 v72.07,102.55
CS_EEPROM_8K  (via drill 0.6 pad 1.42)
  Top 0.406: v52.07,11.11 v52.07,65.41
  Bottom 0.406: v52.07,65.41 60.33,65.41 61.59,66.67 U$1.20
  Bottom 0.61: v52.07,11.11 IC6.6
CS_EPROM_8K  (via drill 0.6 pad 1.42)
  Top 0.406: v66.36,14.92 v66.36,65.41
  Bottom 0.406: IC6.5 60.64,13.65 61.91,14.92 v66.36,14.92 | v66.36,65.41 79.38,65.41 80.64,66.67 U$2.20
CS_EPROM_32K  (via drill 0.6 pad 1.42)
  Top 0.406: v85.72,65.41 v85.72,12.38
  Bottom 0.406: 41.27,16.19 IC5.11 46.99,16.19 50.8,12.38 v85.72,12.38 | U$3.20 99.69,66.67 98.42,65.41 v85.72,65.41
CS_RAM_8K  (via drill 0.6 pad 1.42)
  Top 0.406: v49.53,65.41 v49.53,16.19
  Bottom 0.406: U$4.20 45.09,66.67 46.35,65.41 v49.53,65.41
  Bottom 0.61: v49.53,16.19 IC6.4
D0  (via drill 0.6 pad 1.42)
  Top 0.406: v92.71,84.45 v92.71,71.75 | v124.46,74.3 v124.46,83.19
  Bottom 0.406: U$5.33 28.57,87 26.04,84.45 26.04,76.2 29.21,73.03 45.09,73.03 46.35,71.75 U$4.11 60.33,71.75 61.59,73.03 64.14,73.03 65.41,71.75 U$1.11 79.38,71.75 80.64,73.03 83.19,73.03 84.45,71.75 v92.71,71.75 U$2.11 98.42,71.75 99.69,73.03 102.23,73.03 103.5,71.75 U$3.11 121.92,71.75 v124.46,74.3 | IC2.3 99.06,85.72 97.79,84.45 v92.71,84.45 | v124.46,83.19 SV1.5
D1  (via drill 0.6 pad 1.42)
  Top 0.406: v106.68,79.38 v106.68,74.3 | v122.56,76.2 v122.56,81.92
  Bottom 0.406: U$5.32 28.57,84.45 26.99,82.87 26.99,77.47 28.89,75.56 45.09,75.56 46.35,74.3 U$4.12 60.33,74.3 61.59,75.56 64.14,75.56 65.41,74.3 U$1.12 79.38,74.3 80.64,75.56 83.19,75.56 84.45,74.3 U$2.12 98.42,74.3 99.69,75.56 102.23,75.56 103.5,74.3 v106.68,74.3 U$3.12 120.65,74.3 v122.56,76.2 | IC2.4 101.6,89.53 102.23,90.17 104.78,90.17 105.41,89.53 105.41,87 106.68,85.72 v106.68,79.38 | v122.56,81.92 140.34,81.92 SV1.6
D2  (via drill 0.6 pad 1.42)
  Top 0.406: v109.22,79.38 v109.22,76.83 | v119.38,76.83 v119.38,79.69
  Bottom 0.406: U$5.31 28.57,81.92 27.94,81.28 27.94,78.74 28.57,78.11 45.09,78.11 46.35,76.83 U$4.13 60.33,76.83 61.59,78.11 64.14,78.11 65.41,76.83 U$1.13 79.38,76.83 80.64,78.11 83.19,78.11 84.45,76.83 U$2.13 98.42,76.83 99.69,78.11 102.23,78.11 103.5,76.83 v109.22,76.83 U$3.13 v119.38,76.83 | IC2.7 v109.22,79.38 | SV1.7 121.6,80.64 120.65,79.69 v119.38,79.69
D3
  Bottom 0.406: U$5.30 U$4.15 45.09,79.38 46.35,78.11 60.33,78.11 61.59,79.38 U$1.15 64.14,79.38 65.41,78.11 79.38,78.11 80.64,79.38 U$2.15 83.19,79.38 84.45,78.11 98.42,78.11 99.69,79.38 U$3.15 102.23,79.38 103.5,78.11 111.76,78.11 | IC2.8 111.76,78.11 | SV1.8 140.34,79.38 121.92,79.38 120.65,78.11 111.76,78.11
D4  (via drill 0.6 pad 1.42)
  Top 0.406: v113.03,79.38 v113.03,75.56
  Bottom 0.406: U$5.29 U$4.16 45.09,76.83 46.35,75.56 60.33,75.56 61.59,76.83 U$1.16 64.14,76.83 65.41,75.56 79.38,75.56 80.64,76.83 U$2.16 83.19,76.83 84.45,75.56 98.42,75.56 99.69,76.83 U$3.16 102.23,76.83 103.5,75.56 v113.03,75.56 120.02,75.56 122.56,78.11 SV1.9 | IC2.13 111.76,90.81 113.03,89.53 v113.03,79.38
D5  (via drill 0.6 pad 1.42)
  Top 0.406: v110.49,81.28 v110.49,73.03
  Bottom 0.406: U$5.28 U$4.17 45.09,74.3 46.35,73.03 60.33,73.03 61.59,74.3 U$1.17 64.14,74.3 65.41,73.03 79.38,73.03 80.64,74.3 U$2.17 83.19,74.3 84.45,73.03 98.42,73.03 99.69,74.3 U$3.17 102.23,74.3 103.5,73.03 v110.49,73.03 121.28,73.03 125.09,76.83 140.34,76.83 SV1.10 | IC2.14 109.22,90.81 110.49,89.53 v110.49,81.28
D6  (via drill 0.6 pad 1.42)
  Top 0.406: v107.95,81.28 v107.95,70.48
  Bottom 0.406: U$5.27 U$4.18 45.09,71.75 46.35,70.48 60.33,70.48 61.59,71.75 U$1.18 64.14,71.75 65.41,70.48 79.38,70.48 80.64,71.75 U$2.18 83.19,71.75 84.45,70.48 98.42,70.48 99.69,71.75 U$3.18 102.23,71.75 103.5,70.48 v107.95,70.48 122.56,70.48 127.64,75.56 SV1.11 | IC2.17 101.6,94.3 102.87,93.03 106.68,93.03 107.95,91.76 v107.95,81.28
D7  (via drill 0.6 pad 1.42)
  Top 0.406: v94.3,83.19 v94.3,67.94
  Bottom 0.406: U$5.26 U$4.19 45.09,69.22 46.35,67.94 60.33,67.94 61.59,69.22 U$1.19 64.14,69.22 65.41,67.94 79.38,67.94 80.64,69.22 U$2.19 83.19,69.22 84.45,67.94 v94.3,67.94 98.42,67.94 99.69,69.22 U$3.19 102.23,69.22 103.5,67.94 121.6,67.94 127.95,74.3 140.34,74.3 SV1.12 | IC2.18 99.06,90.81 100.33,89.53 100.33,85.41 98.11,83.19 v94.3,83.19
GND  (via drill 0.6 pad 1.42)
  Top 0.61: v61.59,104.78 v61.59,109.86 | v90.81,109.86 v90.81,104.78 | v127,97.79 v127,89.53 | v19.68,21.91 v30.16,21.91 | v59.69,16.19 v59.69,7.3
  Top 0.813: v33.66,56.52 v33.66,40.96
  Bottom 1.016: 98.32,40.41 C3.2 98.4,40.38 | U$5.21 v33.66,56.52
  pour Bottom (isolate 0.61, no thermals): 0,117.47 0,0 151.13,0 151.13,117.47
IRQ  (via drill 0.6 pad 1.42)
  Top 0.406: v19.86,94.61 v19.86,34.92
  Bottom 0.406: v19.86,34.92 120.97,34.92 137.48,51.44 140.34,51.44 SV1.30
  Bottom 0.61: U$5.4 R3.1 v19.86,94.61
N$1
  Bottom 0.61: R6.1 40.01,100.65 39.05,99.69 IC7.2
N$2
  Bottom 0.61: R2.1 U$5.38
N$3
  Bottom 0.813: JP1.2 IC7.1
N$4
  Bottom 0.61: R7.1 U$5.36
N$5
  Bottom 0.61: R5.1 U$5.2
N$6
  Bottom 0.61: IC2.19 96.52,97.64 R11.1
N$7
  Bottom 0.813: R10.1 QG1.1
N$8
  Bottom 0.406: IC9.4 99.38,15.88 93.34,9.84 58.74,9.84 57.47,8.57 IC6.7
N$9
  Bottom 0.813: LED1.K R11.2
N$11  (via drill 0.6 pad 1.42)
  Top 0.406: v110.49,92.08 v97.47,92.08
  Bottom 0.406: IC2.11 116.84,97.16 115.89,98.11 111.12,98.11 110.49,97.47 v110.49,92.08 | v97.47,92.08 80.64,92.08 78.42,89.85 IC10.8
N$12
  Bottom 0.813: IC10.9 IC10.10 IC10.11
N$13
  Bottom 0.61: IC10.3 72.71,100.01 75.25,102.55 IC10.13
N$14
  Bottom 0.61: IC10.6 71.75,92.39 73.34,93.98 73.34,98.42 74.93,100.01 IC10.12
N$15
  Bottom 0.406: IC2.6 106.68,90.17 105.41,91.44 102.23,91.44 100.33,93.34 100.33,97.48 103.2,100.36 R8.1
N$16
  Bottom 0.813: IC9.10 JP2.1
N$17
  Bottom 0.813: LED2.K R8.2 | R8.2
N$18
  Bottom 0.406: IC5.10 40.64,13.65 35.56,18.73 IC5.3
N$20
  Bottom 0.61: IC9.6 98.11,10.79 R9.1
N$22
  Bottom 0.813: IC9.9 JP2.2
N$23  (via drill 0.6 pad 1.27)
  other vias: 5,112.31
N$24  (via drill 0.6 pad 1.27)
  other vias: 145.97,5
N$25  (via drill 0.6 pad 1.27)
  other vias: 145.97,112.31
N$37  (via drill 0.6 pad 1.27)
  other vias: 5,5
NMI  (via drill 0.6 pad 1.42)
  Top 0.406: v17.78,92.08 v17.78,32.07
  Bottom 0.406: v17.78,32.07 22.23,32.07 24.13,33.97 121.28,33.97 137.48,50.16 SV1.31
  Bottom 0.61: U$5.6 v17.78,92.08 R4.1
OUT_1
  Bottom 0.406: IC2.16 104.14,96.52 107.63,100.01 117.79,100.01 122.24,95.57 129.54,95.57 136.84,88.27 SV1.1
OUT_2
  Bottom 0.406: IC2.15 106.68,97.16 108.58,99.06 117.16,99.06 121.92,94.3 129.22,94.3 136.53,87 140.34,87 SV1.2
OUT_3
  Bottom 0.406: SV1.3 136.21,85.72 128.91,93.03 115.89,93.03 114.3,94.61 IC2.12
OUT_4
  Bottom 0.406: 114.3,88.9 IC2.9 114.3,90.17 115.89,91.76 128.59,91.76 135.89,84.45 140.34,84.45 SV1.4
RD  (via drill 0.6 pad 1.42)
  Top 0.406: v48.26,32.7 v48.26,60.33
  Bottom 0.406: U$4.22 45.09,61.59 46.35,60.33 v48.26,60.33 60.33,60.33 61.59,61.59 U$1.22 64.14,61.59 65.41,60.33 79.38,60.33 80.64,61.59 U$2.22 83.19,61.59 84.45,60.33 98.42,60.33 99.69,61.59 U$3.22 | IC5.6 26.99,11.11 22.54,15.56 22.54,30.8 24.45,32.7 v48.26,32.7 121.28,32.7 136.21,47.62 SV1.33
RST  (via drill 0.6 pad 1.42)
  Top 0.406: v27.94,104.78 v27.94,88.27 | v21.59,81.92 v21.59,36.2
  Bottom 0.406: v21.59,36.2 120.97,36.2 137.48,52.7 SV1.29 | U$5.40 41.91,104.78 43.18,103.5 43.18,98.42 44.45,97.16 IC7.6 | v21.59,81.92 v27.94,88.27
  Bottom 0.61: U$5.40 v27.94,104.78 R1.1
RW  (via drill 0.6 pad 1.42)
  Top 0.406: v26.67,28.26 v26.67,89.53
  Bottom 0.406: v26.67,89.53 U$5.34 | 35.56,16.19 IC5.4 32.38,16.19 | 32.38,16.19 28.57,16.19 26.67,18.1 v26.67,28.26 27.62,29.21 121.6,29.21 136.21,43.81 140.34,43.81 SV1.36 | 32.38,16.19 32.38,20 33.66,21.27 IC5.2
  Bottom 0.813: IC5.1 IC5.2
VCC  (via drill 0.6 pad 1.42)
  Top 0.406: v55.24,50.16 v55.24,43.18
  Top 0.61: v11.43,25.72 v31.75,25.72
  Bottom 0.406: C12.1 | C11.1 41.91,25.72 | C13.1 | R7.2 | U$4.26 45.09,51.44 46.35,50.16 v55.24,50.16 | R10.2
  Bottom 0.61: C16.+ | R6.2 40.01,107.31 | C15.+ 102.23,107.31
  Bottom 0.813: 22.71,92.1 R4.2
  Bottom 1.016: R5.2 | R2.2 | R1.2 | v31.75,25.72 41.91,25.72 C12.1 97.79,25.72 | R9.2 97.47,25.4 97.79,25.72 | 97.79,25.72 C13.1 | IC7.8
  Bottom 1.27: R4.2 22.68,87 U$5.8 C6.1 | U$4.28 C1.1 | U$3.28 C3.1 | C1.1 | 22.71,92.1 R7.2 R3.2 R2.2 | R2.2 R5.2 | R5.2 R1.2 | C1.1 11.43,43.18 | C6.1 | C6.1 C16.+ 11.43,43.18 | 22.71,107.31 R1.2 | C4.1 R10.2 C8.1 | C4.1 QG1.14 | C4.1 75.56,107.31 | 75.56,107.31 93.98,107.31 | 93.98,107.31 C7.1 | C7.1 IC2.20 | 100.94,43.18 C3.1 | v11.43,25.72 11.43,43.18 | JP3.2 138.43,99.69 130.81,107.31 C10.+ LED2.A 102.23,107.31 LED1.A 93.98,107.31 | IC10.14 C9.1 75.58,107.33 75.56,107.31 | C11.1 IC5.14 | C12.1 IC6.16 | C13.1 IC9.16 | 22.71,107.32 22.71,107.31 | C8.1 | C8.1 | C8.1 IC7.8 | C8.1 | 22.71,107.31 40.01,107.31 C8.1 | C3.1 110.47,43.16 113.67,46.35 U$3.1 | C17.1 U$2.28 U$2.27 | C2.1 C17.1 | C17.1 97.16,43.18 | 97.16,43.18 100.94,43.18 C3.1 | U$2.1 97.16,43.18 | C7.1 | U$1.28 C2.1 | C2.1 v55.24,43.18 C1.1
WATCHDOG_RESET  (via drill 0.6 pad 1.42)
  Top 0.406: v59.69,96.2 v48.26,96.2
  Bottom 0.406: v48.26,96.2 48.26,98.11 46.67,99.69 IC7.7 | v59.69,96.2 59.69,92.08 60.64,91.12 71.75,91.12 74.61,88.27 78.11,88.27 80.64,90.81 95.89,90.81 96.52,90.17 IC2.2
WR  (via drill 0.6 pad 1.42)
  Top 0.406: v50.8,31.43 v50.8,47.62 | v70.8,47.62 v70.8,94.93
  Bottom 0.406: U$4.27 45.09,48.9 46.35,47.62 v50.8,47.62 60.33,47.62 61.59,48.9 U$1.27 64.14,48.9 65.41,47.62 v70.8,47.62 | IC5.8 41.27,8.57 37.47,12.38 27.94,12.38 23.81,16.51 23.81,30.48 24.77,31.43 v50.8,31.43 121.28,31.43 136.21,46.35 140.34,46.35 SV1.34
  Bottom 0.813: v70.8,94.93 IC10.5 IC10.4